# Altium project Sleep_Tracker.PrjPcb
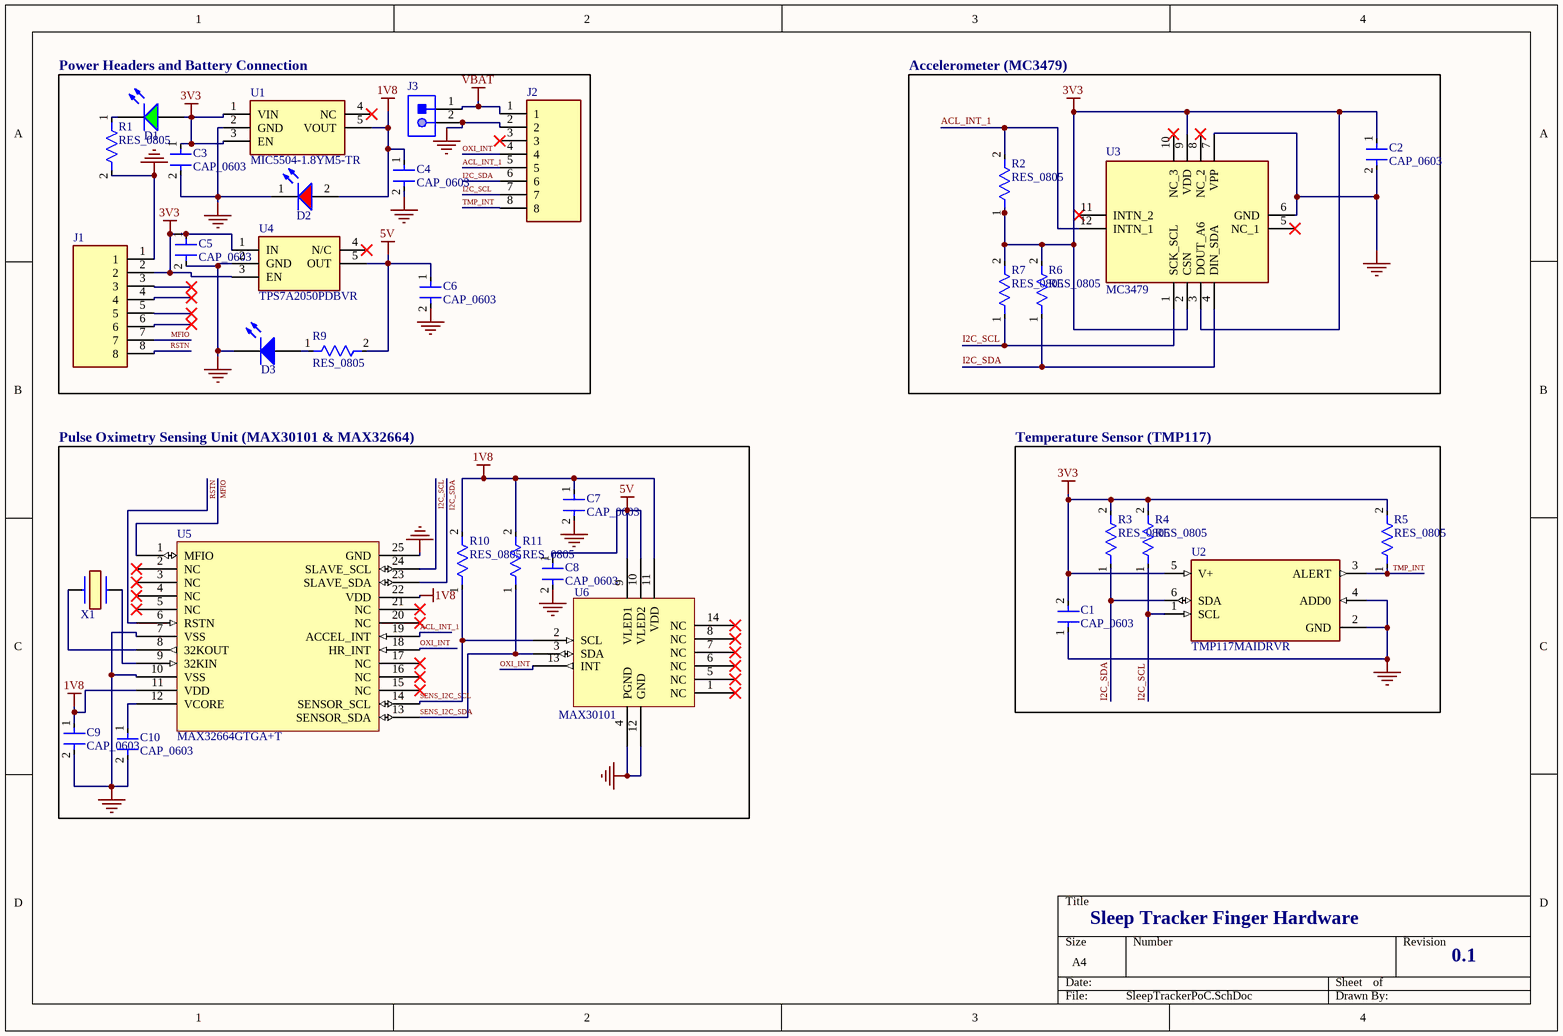
[diagram p0: SleepTrackerPoC.SchDoc]
1 sheet, 33 parts. Net scope: global (net labels, ports and power ports of the same name join across sheets).
Board file: SleepTrackerPoC.PcbDoc

## Sheet SleepTrackerPoC.SchDoc
size A4; SheetNumber: 1; SheetTotal: 1

### Parts
C1  CAP_0603  [CAP_0603]
C2  CAP_0603  [CAP_0603]
C3  CAP_0603  [CAP_0603]
C4  CAP_0603  [CAP_0603]
C5  CAP_0603  [CAP_0603]
C6  CAP_0603  [CAP_0603]
C7  CAP_0603  [CAP_0603]
C8  CAP_0603  [CAP_0603]
C9  CAP_0603  [CAP_0603]
C10  CAP_0603  [CAP_0603]
D1  150080VS75000  [WL-SMCW_0805_150080xx75000]  (value not drawn)
D2  150080RS75000  [WL-SMCW_0805_150080xx75000]  (value not drawn)
D3  150080BS75000  [WL-SMCW_0805_150080xx75000]  (value not drawn)
J1  90147-1108  [RHDR8W70P0X254_1X8_2017X244X870P]  (value not drawn)
J2  90147-1108  [RHDR8W70P0X254_1X8_2017X244X870P]  (value not drawn)
J3  S2B-PH-K-S(LF)(SN)  [JST-S2B-PH-K-S_V]  (value not drawn)
R1  RES_0805  [RES_0805]
R2  RES_0805  [RES_0805]
R3  RES_0805  [RES_0805]
R4  RES_0805  [RES_0805]
R5  RES_0805  [RES_0805]
R6  RES_0805  [RES_0805]
R7  RES_0805  [RES_0805]
R9  RES_0805  [RES_0805]
R10  RES_0805  [RES_0805]
R11  RES_0805  [RES_0805]
U1  MIC5504-1.8YM5-TR  [SOT95P280X145-5N]
U2  TMP117MAIDRVR  [FP-DRV0006B-IPC_C]
U3  MC3479  [MC3479]
U4  TPS7A2050PDBVR  [SOT95P280X145-5N]
U5  MAX32664GTGA+T  [MAX32664]
U6  MAX30101  [MAX30101]
X1  CFS-20632768DZBB  [CFS20632768DZBB]  (value not drawn)

### Blocks framed on the sheet
Power Headers and Battery Connection: C3-C6 D1-D3 J1-J3 R1 R9 U1 U4
Accelerometer (MC3479): C2 R2 R6 R7 U3
Pulse Oximetry Sensing Unit (MAX30101 & MAX32664): C7-C10 R10 R11 U5 U6 X1
Temperature Sensor (TMP117): C1 R3-R5 U2

### Nets
1V8: C4.1 C7.1 C9.1 D2.2(A) R10.2 R11.2 U1.5(VOUT) U5.11(VDD) U5.22(VDD) U6.11(VDD)
3V3: C1.2 C2.1 C3.1 C5.1 D1.2(A) J1.2 R2.1 R3.2 R4.2 R5.2 R6.2 R7.2 U1.1(VIN) U1.3(EN) U2.5(V+) U3.2(CSN) U3.3(DOUT_A6) U3.9(VDD) U4.1(IN) U4.3(EN)
5V: C6.1 C8.1 R9.2 U4.5(OUT) U6.9(VLED1) U6.10(VLED2)
GND: C1.1 C2.2 C3.2 C4.2 C5.2 C6.2 C7.2 C8.2 C9.2 C10.2 D2.1(K) D3.1(K) J1.1 J2.2 J3.2 R1.2 U1.2(GND) U2.2(GND) U2.4(ADD0) U3.6(GND) U3.7(VPP) U4.2(GND) U5.7(VSS) U5.10(VSS) U5.25(GND) U6.4(PGND) U6.12(GND)
VBAT: J2.1 J3.1
ACL_INT_1: J2.5 R2.2 U3.12(INTN_1) U5.19(ACCEL_INT)
I2C_SCL: J2.7 R4.1 R7.1 U2.1(SCL) U3.1(SCK_SCL) U5.24(SLAVE_SCL)
I2C_SDA: J2.6 R3.1 R6.1 U2.6(SDA) U3.4(DIN_SDA) U5.23(SLAVE_SDA)
MFIO: J1.7 U5.1(MFIO)
OXI_INT: J2.4 U5.18(HR_INT) U6.13(INT)
RSTN: J1.8 U5.6(RSTN)
SENS_I2C_SCL: R10.1 U5.14(SENSOR_SCL) U6.2(SCL)
SENS_I2C_SDA: R11.1 U5.13(SENSOR_SDA) U6.3(SDA)
TMP_INT: J2.8 R5.1 U2.3(ALERT)
NetC10_1: C10.1 U5.12(VCORE)
NetD1_1: D1.1(K) R1.1
NetD3_2: D3.2(A) R9.1
NetU5_8: U5.8(32KOUT) X1.2
NetU5_9: U5.9(32KIN) X1.1

Not connected (* = marked no-connect by the designer): J1 3* 4* 5* 6*; J2 3*; U1 4(NC)*; U3 5(NC_1)* 8(NC_2)* 10(NC_3)* 11(INTN_2)*; U4 4(N/C)*; U5 2(NC)* 3(NC)* 4(NC)* 5(NC)* 15(NC)* 16(NC)* 17(NC)* 20(NC)* 21(NC)*; U6 1(NC)* 5(NC)* 6(NC)* 7(NC)* 8(NC)* 14(NC)*

### Notes on the sheet
- Sleep Tracker Finger Hardware
- 0.1

### Library data of the parts
C1-C10 = Capacitor SMT 0603: Manufacturer: *; Manufacturer Part Number: *; Tolerance: *; Package Sizing: *; Voltage Rating: *
D1 = CMP-1426-00009-6: WL-SMCW SMT Mono-Color Chip LED Waterclear; Color: Green; Dominant Wavelength: 570nm; Lens Style: Clear, Rectangular; Test Current: 20mA; Max Junction Temperature (Tj): 95°C; Max Reverse Voltage (DC): 5V; Forward Voltage: 2V; Forward Current: 100mA; Viewing Angle: 140°; Power Dissipation: 72mW; Peak Wavelength: 572nm; Luminous Intensity: 40mcd; Max Operating Temperature: 85°C; Case/Package: 0805; Case Code (Metric): 2012; RoHS: Compliant; Packaging: Tape and Reel; Min Operating Temperature: -40°C; Width: 1.25mm; Wavelength: 570nm; Mount: Surface Mount; Length: 2mm; REACH SVHC: Unknown; Height: 700µm; Case Code (Imperial): 0805; Reverse Voltage: 5V
D2 = CMP-1426-00011-3: LED Uni-Color Red 630nm 2-Pin Chip 0805(2012Metric) T/R; Viewing Angle: 140°; Max Junction Temperature (Tj): 95°C; Power Dissipation: 72mW; Forward Current: 100mA; Forward Voltage: 2V; Wavelength: 625nm; Test Current: 20mA; Max Reverse Voltage (DC): 5V; Luminous Intensity: 150mcd; Lens Style: Clear, Rectangular; REACH SVHC: Unknown; Height: 700µm; Case Code (Metric): 2012; Peak Wavelength: 630nm; Length: 2mm; Width: 1.25mm; RoHS: Compliant; Packaging: Tape and Reel; Dominant Wavelength: 625nm; Color: Red; Case Code (Imperial): 0805; Min Operating Temperature: -40°C; Mount: Surface Mount; Max Operating Temperature: 85°C; Case/Package: 0805
D3 = CMP-1426-00008-7: Led, Blue, 470 Nm, 3.2 V, 30 Ma, 145 Mcd Rohs Compliant: Yes; Test Current: 20mA; Lens Style: Clear, Rectangular; Forward Current: 100mA; Power Dissipation: 105mW; Dominant Wavelength: 470nm; Reverse Voltage: 5V; Viewing Angle: 140°; Luminous Intensity: 145mcd; Forward Voltage: 3.2V; Max Junction Temperature (Tj): 95°C; Peak Wavelength: 465nm; Min Operating Temperature: -40°C; Mount: Surface Mount; Case Code (Imperial): 0805; Packaging: Tape and Reel; Lead Free: Lead Free; Length: 2mm; Case/Package: 0805; Case Code (Metric): 2012; Max Operating Temperature: 85°C; Height: 700µm; RoHS: Compliant; Color: Blue; Max Reverse Voltage (DC): 5V; REACH SVHC: Unknown; Width: 1.25mm; Wavelength: 470nm
J1 J2 = 90147-1108: Headers & Wire Housings 8CKT VERT SR CON; Manufacturer_Name: Molex; Geometry.Height: 8.7mm; Mouser Part Number: 538-90147-1108; Mouser Price/Stock: https://www.mouser.co.uk/ProductDetail/Molex/90147-1108?qs=QESXi79X%252BKqiwXr7kUdEeg%3D%3D; Manufacturer_Part_Number: 90147-1108; Datasheet Link: https://www.molex.com/pdm_docs/sd/901471102_sd.pdf
J3 = CMP-1755-00004-1: Male Header, Pitch 2 mm, 1 x 2 Position, Height 4.8 mm, Tail Length 3.4 mm, -25 to 85 degC, RoHS, Bulk; Case\Package: Radial; Tolerance: 20%; Capacitance: 10 uF; Voltage Rating (DC): 50 V; Packaging: Bulk; ComponentLink1URL: http://www.jst-mfg.com/product/pdf/eng/ePH.pdf; Radiation Hardening: No; Height: 11 mm; Package Quantity: 200; PackageDescription: Male Header, Pitch 2 mm, 1 x 2 Position, Height 4.8 mm, Tail Length 3.4 mm; PackageReference: S2B-PH-K-S; Diameter: 5 mm; Pins: 2; Mount: Through Hole; Max Operating Temperature: 85 degC; Min Operating Temperature: -40 degC; ComponentLink1Description: Datasheet; DatasheetVersion: Dec-12; Length: 11 mm; Lead Pitch: 2 mm; REACH SVHC: No SVHC; Voltage Rating: 50 V; RoHSCompliant: true
R1-R7 R9-R11 = Resistor SMT 0805: Manufacturer: *; Manufacturer Part Number: *; Tolerance: *; Package Sizing: *; Voltage Rating: *
U1 = MIC5504-1.8YM5-TR: Linear Voltage Regulator IC Positive Fixed Output 1.8V 300mA SOT-23-5; Manufacturer_Name: Microchip; Geometry.Height: 1.45mm; Mouser Part Number: 998-MIC5504-1.8YM5TR; Mouser Price/Stock: https://www.mouser.co.uk/ProductDetail/Microchip-Technology/MIC5504-1.8YM5-TR?qs=U6T8BxXiZAWcKt0MaB%252BQvA%3D%3D; Manufacturer_Part_Number: MIC5504-1.8YM5-TR; Datasheet Link: http://www.microchip.com/mymicrochip/filehandler.aspx?ddocname=en580292
U2 = CMP-04948-000036-1: TEMPERATURE SENSOR; Resolution: 16b; Output Type: I2C; Packaging: Cut Tape; Mount: Surface Mount; Min Operating Temperature: -55°C; Max Operating Temperature: 150°C; RoHS Compliant: Yes
U3 = MC3479: Accelerometers Small Digital 3-axis Accelerometer Sensor; Manufacturer_Name: MEMSIC; Geometry.Height: 1mm; Mouser Part Number: 498-MC3479; Mouser Price/Stock: https://www.mouser.co.uk/ProductDetail/MEMSIC/MC3479?qs=OlC7AqGiEDmYmlaMvA9fTA%3D%3D; Manufacturer_Part_Number: MC3479; Datasheet Link: http://www.memsic.com/uploadfiles/2020/08/20200827164636363.pdf
U4 = TPS7A2050PDBVR: LDO Voltage Regulators 300-mA, ultra-low-noise, low-IQ, low-dropout (LDO) linear regulator with high PSRR; Manufacturer_Name: Texas Instruments; Geometry.Height: 1.45mm; Mouser Part Number: 595-TPS7A2050PDBVR; Mouser Price/Stock: https://www.mouser.co.uk/ProductDetail/Texas-Instruments/TPS7A2050PDBVR?qs=hd1VzrDQEGgpoyZ%2F5FZYnQ%3D%3D; Manufacturer_Part_Number: TPS7A2050PDBVR; Datasheet Link: https://www.ti.com/lit/gpn/tps7a20?HQS=ti-null-null-sf-df-pf-sep-wwe&DCM=yes
U5 = MAX32664GTGA+T: Maxim Integrated MAX32664GTGA+T Sensor Hub
U6 = MAX30101: Maxim Integrated MAX30101 Oximetry Sensor
X1 = CFS-20632768DZBB: 32.768 kHz +/-20ppm Crystal 6pF 35 kOhms Cylindrical Can, Radial; Manufacturer_Name: CITIZEN FINEDEVICE; Geometry.Height: 6.2mm; Mouser Part Number: 695-CFS-20632768DZBB; Mouser Price/Stock: https://www.mouser.co.uk/ProductDetail/Citizen-FineDevice/CFS-20632768DZBB?qs=byeeYqUIh0PqzGU2nG5Zjg%3D%3D; Manufacturer_Part_Number: CFS-20632768DZBB; Datasheet Link: http://cfd.citizen.co.jp/cms/cfd/pdf/english/CFS-206_CFS-145_E.pdf